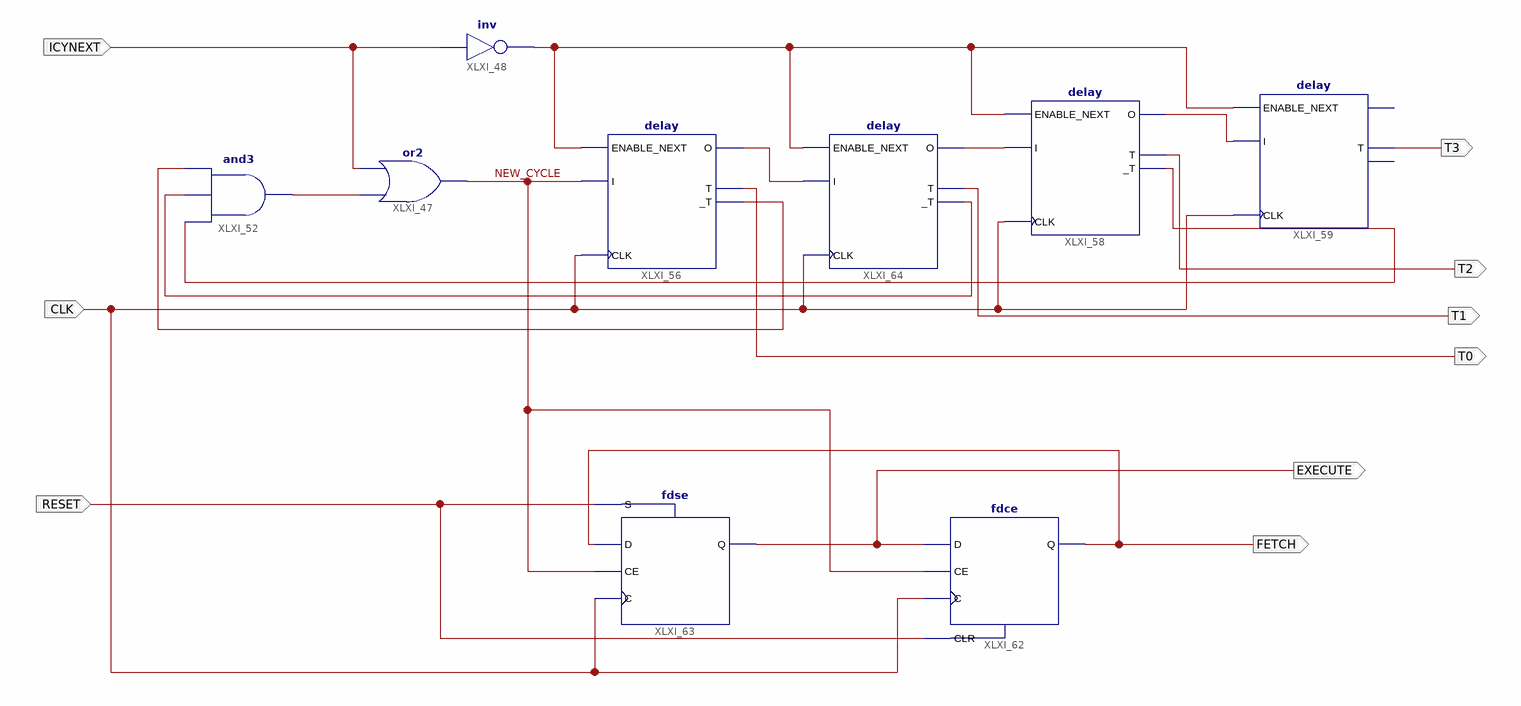
[diagram p0: schematic sheet 1]
// Xilinx ISE schematic system_timing.sch (spartan6) as structural Verilog: 9 symbols, 9 ports
module system_timing (
  input  CLK,
  input  ICYNEXT,
  input  RESET,
  output T0,
  output T1,
  output T2,
  output T3,
  output FETCH,
  output EXECUTE
);

  wire _ICYNEXT, _T0, _T1, _T2, NEW_CYCLE, XLXN_259, XLXN_311, XLXN_343, XLXN_356;

  or XLXI_47 (NEW_CYCLE, XLXN_259, ICYNEXT);
  not XLXI_48 (_ICYNEXT, ICYNEXT);
  and XLXI_52 (XLXN_259, _T2, _T1, _T0);
  delay XLXI_56 (.ENABLE_NEXT(_ICYNEXT), .O(XLXN_356), .T(T0), ._T(_T0), .I(NEW_CYCLE), .CLK(CLK));
  delay XLXI_59 (.ENABLE_NEXT(_ICYNEXT), .T(T3), .I(XLXN_343), .CLK(CLK));  // open: O, _T
  fdce XLXI_62 (.C(CLK), .CE(NEW_CYCLE), .CLR(RESET), .D(EXECUTE), .Q(FETCH));
  fdse XLXI_63 (.C(CLK), .CE(NEW_CYCLE), .D(FETCH), .S(RESET), .Q(EXECUTE));
  delay XLXI_64 (.ENABLE_NEXT(_ICYNEXT), .O(XLXN_311), .T(T1), ._T(_T1), .I(XLXN_356), .CLK(CLK));
  delay XLXI_58 (.ENABLE_NEXT(_ICYNEXT), .O(XLXN_343), .T(T2), ._T(_T2), .I(XLXN_311), .CLK(CLK));
endmodule
